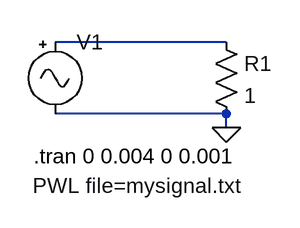
[diagram p0: schematic test1.asc]
test1.asc, the LTspice schematic file:
Version 4
SHEET 1 880 680
WIRE 96 112 -96 112
WIRE 96 192 -96 192
WIRE 96 208 96 192
FLAG 96 208 0
SYMBOL res 80 96 R0
SYMATTR InstName R1
SYMATTR Value 1
SYMBOL Misc\\signal -96 96 R0
WINDOW 123 0 0 Left 0
WINDOW 39 0 0 Left 0
WINDOW 3 -25 177 Left 2
SYMATTR InstName V1
SYMATTR Value PWL file=mysignal.txt
TEXT -120 240 Left 2 !.tran 0 0.004 0 0.001

The netlist it stands for:
* test1.asc
R1 N001 0 1
V1 N001 0 PWL file=mysignal.txt
.tran 0 0.004 0 0.001
.backanno
.end